# Altium schematic sheet Power.SchDoc
size A4; SheetNumber: 8; SheetTotal: 8
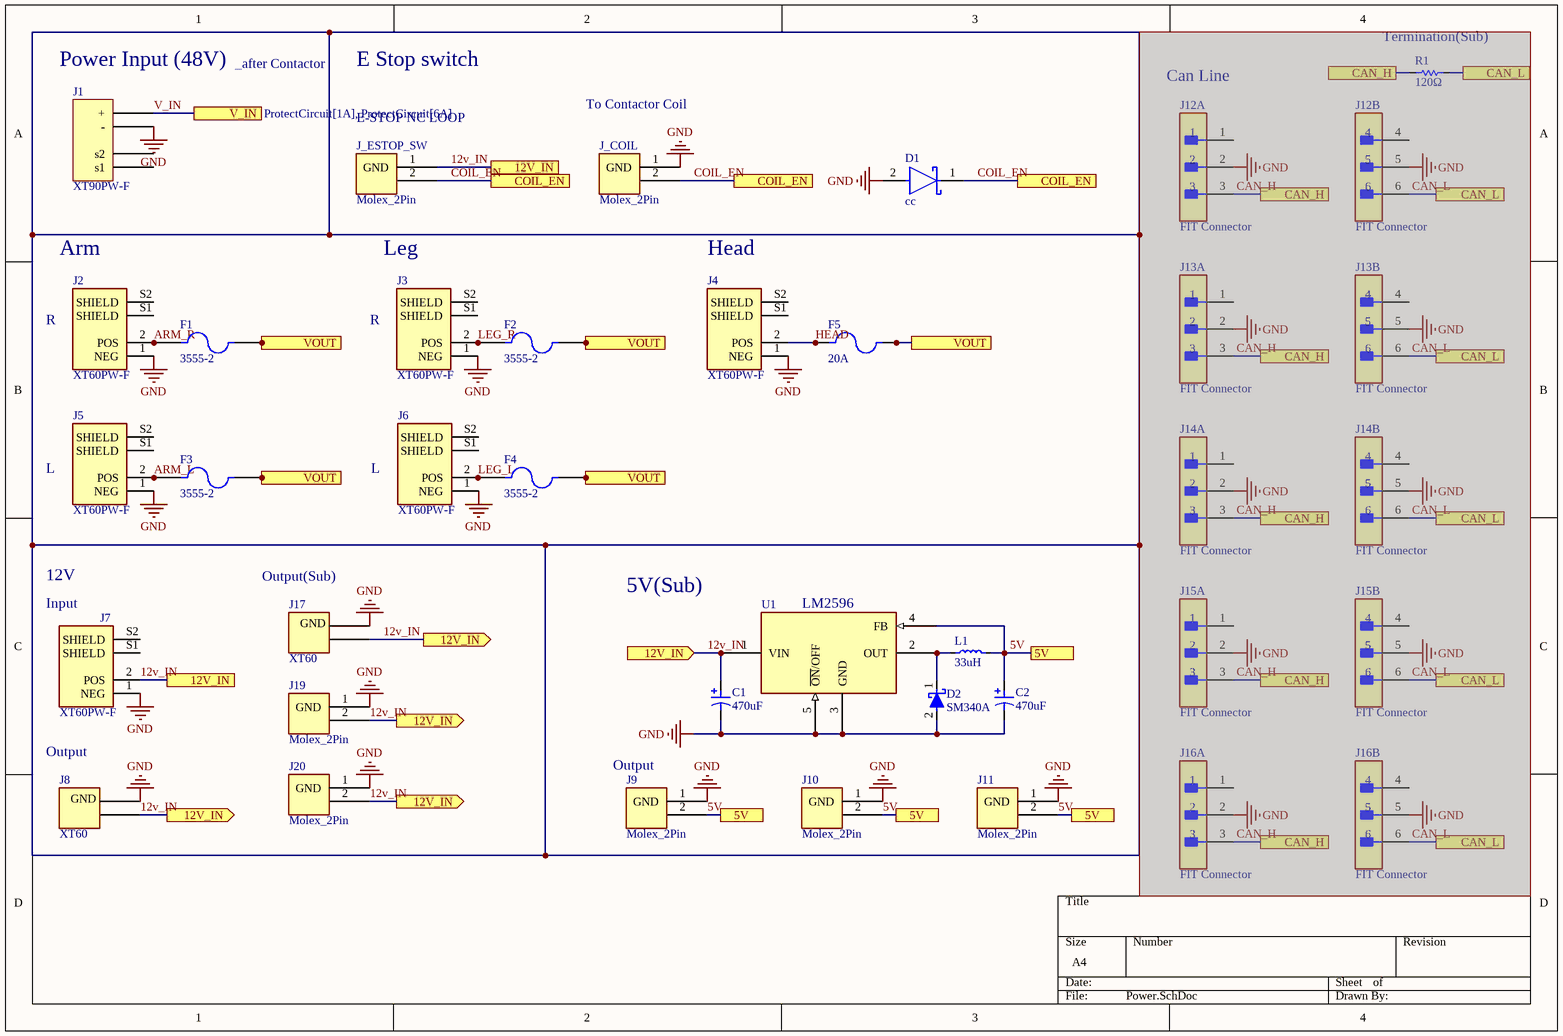
[diagram p0: Power.SchDoc]

## Parts
C1  Capacitance: 470uF  [SMD_Capacitor_electrolytic]  (hidden comment: Polar_Capacitors)
C2  Capacitance: 470uF  [SMD_Capacitor_electrolytic]  (hidden comment: Polar_Capacitors)
D1  cc  [FP-403A-03-MFG]
D2  SM340A  [SMD_Diode_schottky]
F1  3555-2  [FUSE_3555-2]
F2  3555-2  [FUSE_3555-2]
F3  3555-2  [FUSE_3555-2]
F4  3555-2  [FUSE_3555-2]
F5  20A  [FUSE_CNX-02]
J1  XT90PW-F  [AMASS_XT90PW-F]
J2  XT60PW-F  [XT60PW-F]
J3  XT60PW-F  [XT60PW-F]
J4  XT60PW-F  [XT60PW-F]
J5  XT60PW-F  [XT60PW-F]
J6  XT60PW-F  [XT60PW-F]
J7  XT60PW-F  [XT60PW-F]
J8  XT60  [XT60_F]
J9  Molex_2Pin  [MOLEX_2PIN]
J10  Molex_2Pin  [MOLEX_2PIN]
J11  Molex_2Pin  [MOLEX_2PIN]
J12  FIT Connector  [FP-43045-0601-MFG]  (parts A,B of 2)  (masked out: inside a compile mask, not in the netlist)
J13  FIT Connector  [FP-43045-0601-MFG]  (parts A,B of 2)  (masked out: inside a compile mask, not in the netlist)
J14  FIT Connector  [FP-43045-0601-MFG]  (parts A,B of 2)  (masked out: inside a compile mask, not in the netlist)
J15  FIT Connector  [FP-43045-0601-MFG]  (parts A,B of 2)  (masked out: inside a compile mask, not in the netlist)
J16  FIT Connector  [FP-43045-0601-MFG]  (parts A,B of 2)  (masked out: inside a compile mask, not in the netlist)
J17  XT60  [XT60_F]
J19  Molex_2Pin  [MOLEX_2PIN]
J20  Molex_2Pin  [MOLEX_2PIN]
J_COIL  Molex_2Pin  [MOLEX_2PIN]
J_ESTOP_SW  Molex_2Pin  [MOLEX_2PIN]
L1  Inductance: 33uH  [SMD_INDUCTOR_POWER]  (hidden comment: Inductor_Power)
R1  Resistance: 120Ω  [SMD_Resistor]  (hidden comment: Resistor)  (masked out: inside a compile mask, not in the netlist)
U1  LM2596  [SMD_LM2596]

## Ports
5V (see Power[2D], Power[3C], Power[3D]), 5V (see Power[2D], Power[3D]), 5V (see Power[3C], Power[3D]), 12V_IN (in, see Power[1C], Power[1D], Power[2A], Power[2C], Power[2D]), 12V_IN (out, see Power[1C], Power[1D], Power[2A], Power[2C]), 12V_IN (out, see Power[1C], Power[1D], Power[2A], Power[2C], Power[2D]), 12V_IN (out, see Power[1C], Power[2A], Power[2C], Power[2D]), 12V_IN (see Power[1C], Power[1D], Power[2C], Power[2D]), 12V_IN (see Power[1D], Power[2A], Power[2C], Power[2D]), CAN_H, CAN_H (see Power[4A], Power[4B], Power[4C]), CAN_H (see Power[4A], Power[4B], Power[4C], Power[4D]), CAN_H (see Power[4A], Power[4C], Power[4D]), CAN_L (see Power[4A], Power[4B], Power[4C]), CAN_L (see Power[4A], Power[4B], Power[4C], Power[4D]), CAN_L (see Power[4A], Power[4C], Power[4D]), COIL_EN (see Power[2A]), COIL_EN (see Power[2A], Power[3A]), V_IN (see ProtectCircuit[1A], ProtectCircuit[6A]), VOUT (see Power[1B], Power[2B], Power[3B], ProtectCircuit[3A]), VOUT (see Power[1B], Power[2B], ProtectCircuit[3A])

## Nets
GND: C1.1 C2.1 D1.2(A) D2.2 J1.N(-) J2.1(NEG) J3.1(NEG) J4.1(NEG) J5.1(NEG) J6.1(NEG) J7.1(NEG) J8.1 J9.1(GND) J10.1(GND) J11.1(GND) J17.1 J19.1(GND) J20.1(GND) J_COIL.1(GND) U1.3(GND) U1.5(~{ON}/OFF)
5V: C2.2 J9.2 J10.2 J11.2 L1.2 U1.4(FB) ; port 5V
12v_IN: C1.2 J7.2(POS) J8.2 J17.2 J19.2 J20.2 J_ESTOP_SW.1(GND) U1.1(VIN) ; port 12V_IN
ARM_L: F3.1_1 F3.1_2 J5.2(POS)
ARM_R: F1.1_1 F1.1_2 J2.2(POS)
COIL_EN: D1.1(C) J_COIL.2 J_ESTOP_SW.2 ; port COIL_EN
HEAD: F5.1_1 F5.1_2 J4.2(POS)
LEG_L: F4.1_1 F4.1_2 J6.2(POS)
LEG_R: F2.1_1 F2.1_2 J3.2(POS)
V_IN: J1.P(+) ; port V_IN
VOUT: F1.2_1 F1.2_2 F2.2_1 F2.2_2 F3.2_1 F3.2_2 F4.2_1 F4.2_2 F5.2_1 F5.2_2 ; port VOUT
NetD2_1: D2.1 L1.1 U1.2(OUT)

Not connected (* = marked no-connect by the designer): J1 S1(s1) S2(s2); J2 S1(SHIELD) S2(SHIELD); J3 S1(SHIELD) S2(SHIELD); J4 S1(SHIELD) S2(SHIELD); J5 S1(SHIELD) S2(SHIELD); J6 S1(SHIELD) S2(SHIELD); J7 S1(SHIELD) S2(SHIELD)

## Notes on the sheet
- (near R1) Termination(Sub)
- (near J1) Power Input (48V)
- _after Contactor
- E Stop switch
- To Contactor Coil
- Can Line
- (near J_ESTOP_SW) E-STOP NC LOOP
- Arm
- Leg
- (near J4) Head
- R
- L
- 12V
- (near J17) Output(Sub)
- (near J7) Input
- 5V(Sub)
- Output
- (near J9) Output
- (in symbol CMP-019-000061-2) GND

## Library data of the parts
C1 C2 = CMP-024-000022-3: Electrolytic Capacitor; Design Item ID: Capacitor_electrolytic; Source: robit_passive.SchLib
D1 = CMP-026-000004-1: Rectifier Diode, Schottky, 1 Phase, 1 Element, 5A, 100V V(RRM), Silicon
D2 = CMP-026-000009-1: Schottky Barrier Diode; Design Item ID: Diode_schottky; Source: robit_passive.SchLib
F1-F4 = 3555-2: Auto Fuse Holder, 1 Fuse, Blade, Standard, THM, 50Amp, Hi-Temp Nylon, UL94V-0 | Keystone Electronics 3555-2; SnapEDA_Link: https://www.snapeda.com/parts/3555-2/Keystone/view-part/?ref=snap; Package: None; Value: *; MF: Keystone Electronics; MP: 3555-2; Check_prices: https://www.snapeda.com/parts/3555-2/Keystone/view-part/?ref=eda
F5 = CMP-027-000003-2: Fuse Clip for Maxi Blade Fuse, 250VDC/500VAC, 80A; MF: OptiFuse; Source: CNX-02.SchLib; Check_prices: https://www.snapeda.com/parts/CNX-02/Optifuse/view-part/?ref=eda; Component Type: Standard; Value: *; MP: CNX-02; SnapEDA_Link: https://www.snapeda.com/parts/CNX-02/Optifuse/view-part/?ref=snap; Design Item ID: CNX-02; Package: None; Pin Count: 4
J1 = CMP-019-000093-4: Socket, DC supply, XT90, female, PIN:2, on PCBs, THT; MF: AMASS; System: Connector; Pin Count: 2; Value: *; Check_prices: https://www.snapeda.com/parts/XT90PW-F/AMASS/view-part/?ref=eda; Package: Package; SnapEDA_Link: https://www.snapeda.com/parts/XT90PW-F/AMASS/view-part/?ref=snap; MP: XT90PW-F; Component Type: Standard; Source: XT90PW-F.SchLib; Design Item ID: XT90PW-F
J2-J7 = CMP-019-000058-2: Socket DC Supply Connector Female; MF: AMASS; Price: None; Value: *; Package: Package; Check_prices: https://www.snapeda.com/parts/XT60PW-F/AMASS/view-part/?ref=eda; Design Item ID: XT60PW-F; SnapEDA_Link: https://www.snapeda.com/parts/XT60PW-F/AMASS/view-part/?ref=snap; MP: XT60PW-F; Availability: Not in stock; System: Connector; Source: robit_connector.SchLib
J8 J17 = CMP-019-000061-2: XT60 connector; System: Connector
J9-J11 J19 J20 J_COIL J_ESTOP_SW = CMP-019-000043-2: Molex 2Pin Connector; Design Item ID: Molex_2Pin; System: Connector; Source: robit_connector.SchLib
J12-J16 = CMP-019-000001-1: Connector Wire to Board Header 6 Position 3 mm Solder Right Angle Thru-Hole Micro-Fit 3.0™; Connector Type: Plug, Socket; System: Connector; Length: 27.94mm
L1 = CMP-028-000010-1: SMD type Inductor; Source: robit_passive.SchLib; Design Item ID: Inductor_Power
R1 = CMP-029-000004-7: SMD type resistor; Design Item ID: Resistor; Source: robit_passive.SchLib
U1 = CMP-022-000007-1: 5V Transformer; Source: robit_ic.SchLib; Design Item ID: LM2596